# EAGLE board mainboard_eurobotics2010_r6 (EAGLE 4.16)
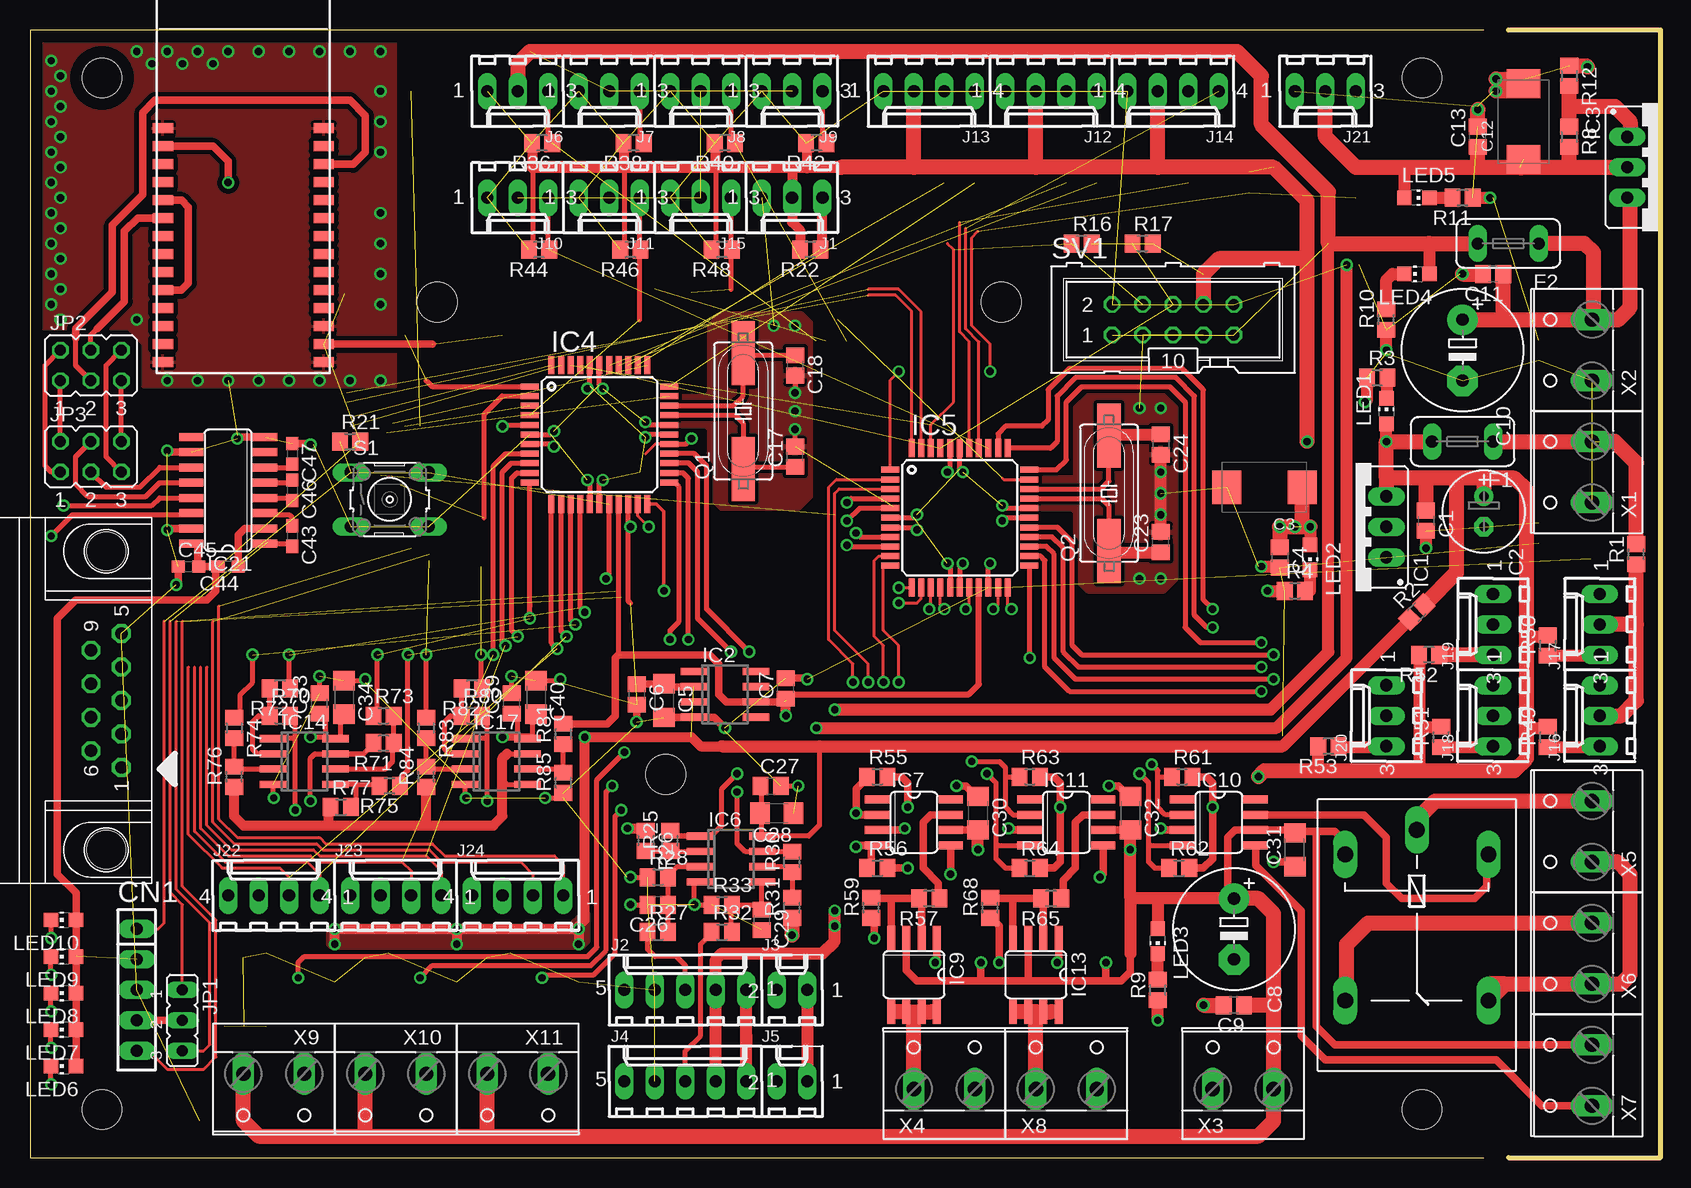
[diagram p9: board, top side]
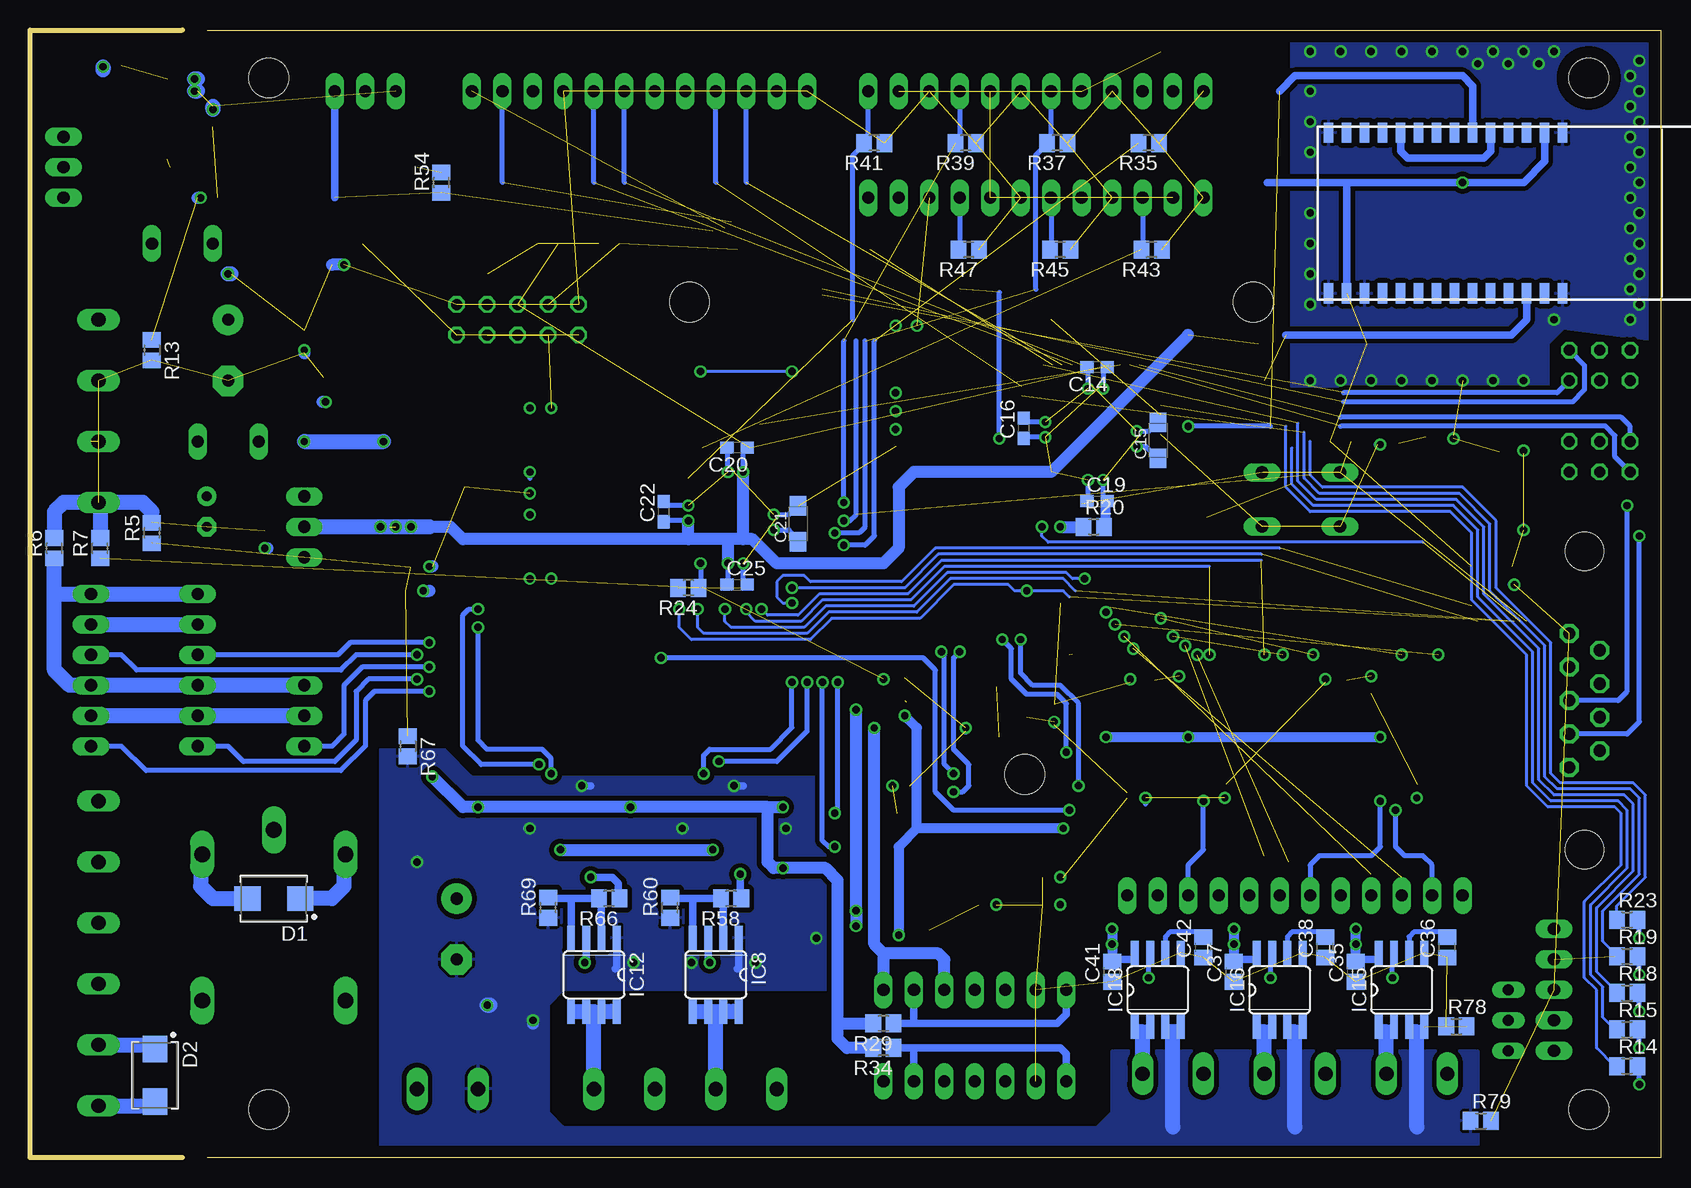
[diagram p10: board, bottom side, seen from below]

Size 135.89 x 94 mm. Coordinates in mm from the lower left corner, seen from the top.
Outline: 121.13,0 0,0 0,94 121.13,94
Outline: 123.19,0 135.89,0 135.89,93.98 123.19,93.98
Copper layers (1*16): Top 0.035mm / dielectric 1.5mm / Bottom 0.035mm
Design rules "olimex": minimum track width 10mil, minimum drill 24mil, track to track 8mil, track to pad 8mil, pad to pad 8mil, via to via 8mil, smd to smd 8mil, copper to edge 40mil, drill to drill 8mil, minimum pad ring 8mil, minimum via ring 8mil, stop-mask expansion 4mil, vias tented up to drill 0mil, thermal gap 10mil
Holes 3.3 mm at 6,4 116,4 6,90 116,90 80.93,71.31 33.94,71.31 52.99,31.94

## Footprints (pad centres in the part's own frame; a part is rotated, then mirrored left to right if it is on the bottom)
C0805 = smd 1.3 x 1.5: 1 -0.85,0; 2 0.85,0
E2,5-7 = drill 0.813 pad 1.6 round: + -1.27,0 | drill 0.813 pad 1.6 octagon: - 1.27,0
SMC_D = smd 2.4 x 2.8: + -3.15,0; - 3.15,0
C1206 = smd 1.6 x 1.8: 1 -1.4,0; 2 1.4,0
E5-10,5 = drill 1.016 pad 2.54 round: + -2.54,0 | drill 1.016 pad 2.54 octagon: - 2.54,0
C0603 = smd 1.1 x 1: 1 -0.85,0; 2 0.85,0
SMC_A = smd 1.6 x 1.4: + -1.5,0; - 1.5,0
SIP-100-5V = drill 1.016 long: 1 -5.08,0; 2 -2.54,0; 3 0,0; 4 2.54,0; 5 5.08,0
D-09F/90 = drill 1.016 pad 1.575 octagon: 1 -5.588,-1.27; 2 -2.794,-1.27; 3 0,-1.27; 4 2.794,-1.27; 5 5.588,-1.27; 6 -4.191,1.27; 7 -1.397,1.27; 8 1.397,1.27; 9 4.191,1.27 | hole 3.2: 12.446,0; -12.446,0
DIOM5436X265N = smd 2.2 x 2.05: A 2.2,0; K -2.2,0
TE5 = drill 1.016 long: 1 -2.54,0; 2 2.54,0
317TS = drill 1.016 long: 1 -2.54,-2.54; 2 0,-2.54; 3 2.54,-2.54
SOIC8 = smd 0.6 x 2.2: 1 -1.905,-2.6; 2 -0.635,-2.6; 3 0.635,-2.6; 4 1.905,-2.6; 5 1.905,2.6; 6 0.635,2.6; 7 -0.635,2.6; 8 -1.905,2.6
TQFP44 = smd 1.5 x 0.5: 1 -5.8,4; 2 -5.8,3.2; 3 -5.8,2.4; 4 -5.8,1.6; 5 -5.8,0.8; 6 -5.8,0; 7 -5.8,-0.8; 8 -5.8,-1.6; 9 -5.8,-2.4; 10 -5.8,-3.2; 11 -5.8,-4; 23 5.8,-4; 24 5.8,-3.2; 25 5.8,-2.4; 26 5.8,-1.6; 27 5.8,-0.8; 28 5.8,0; 29 5.8,0.8; 30 5.8,1.6; 31 5.8,2.4; 32 5.8,3.2; 33 5.8,4 | smd 0.5 x 1.5: 12 -4,-5.8; 13 -3.2,-5.8; 14 -2.4,-5.8; 15 -1.6,-5.8; 16 -0.8,-5.8; 17 0,-5.8; 18 0.8,-5.8; 19 1.6,-5.8; 20 2.4,-5.8; 21 3.2,-5.8; 22 4,-5.8; 34 4,5.8; 35 3.2,5.8; 36 2.4,5.8; 37 1.6,5.8; 38 0.8,5.8; 39 0,5.8; 40 -0.8,5.8; 41 -1.6,5.8; 42 -2.4,5.8; 43 -3.2,5.8; 44 -4,5.8
SO08 = smd 0.6 x 2.2: 1 -1.905,-2.6; 2 -0.635,-2.6; 3 0.635,-2.6; 4 1.905,-2.6; 5 1.905,2.6; 6 0.635,2.6; 7 -0.635,2.6; 8 -1.905,2.6
SO08' = smd 0.66 x 2.032: 1 -1.905,-3.073; 2 -0.635,-3.073; 3 0.635,-3.073; 4 1.905,-3.073; 5 1.905,3.073; 6 0.635,3.073; 7 -0.635,3.073; 8 -1.905,3.073
WT11 = smd 1.7 x 0.8: 1 -6.7,2.5; 2 -6.7,1; 3 -6.7,-0.5; 4 -6.7,-2; 5 -6.7,-3.5; 6 -6.7,-5; 7 -6.7,-6.5; 8 -6.7,-8; 9 -6.7,-9.5; 10 -6.7,-11; 11 -6.7,-12.5; 12 -6.7,-14; 13 -6.7,-15.5; 14 -6.7,-17; 15 6.7,-17; 16 6.7,-15.5; 17 6.7,-14; 18 6.7,-12.5; 19 6.7,-11; 20 6.7,-9.5; 21 6.7,-8; 22 6.7,-6.5; 23 6.7,-5; 24 6.7,-3.5; 25 6.7,-2; 26 6.7,-0.5; 27 6.7,1; 28 6.7,2.5
SO16 = smd 0.66 x 2.032: 1 -4.445,-3.073; 2 -3.175,-3.073; 3 -1.905,-3.073; 4 -0.635,-3.073; 5 0.635,-3.073; 6 1.905,-3.073; 7 3.175,-3.073; 8 4.445,-3.073; 9 4.445,3.073; 10 3.175,3.073; 11 1.905,3.073; 12 0.635,3.073; 13 -0.635,3.073; 14 -1.905,3.073; 15 -3.175,3.073; 16 -4.445,3.073
6410-03 = drill 1.016 long: 1 2.54,0; 2 0,0; 3 -2.54,0
6410-05 = drill 1.016 long: 1 5.08,0; 2 2.54,0; 3 0,0; 4 -2.54,0; 5 -5.08,0
6410-02 = drill 1.016 long: 1 1.27,0; 2 -1.27,0
6410-04 = drill 1.016 long: 1 3.81,0; 2 1.27,0; 3 -1.27,0; 4 -3.81,0
JP2 = drill 0.914 long: 1 -2.54,0; 2 0,0; 3 2.54,0
JP3Q = drill 0.914 octagon: 1 -2.54,-1.27; 2 -2.54,1.27; 3 0,-1.27; 4 0,1.27; 5 2.54,-1.27; 6 2.54,1.27
G5LE = drill 1.321 long: 1 -7.493,-5.969; 2 -7.493,5.969; O 4.699,5.969; P -9.525,0; S 4.699,-5.969
CHIP-LED0805 = smd 1.2 x 1.2: A 0,-1.05; C 0,1.05
HC49UP = smd 5.334 x 1.93: 1 -4.826,0; 2 4.826,0
R0805 = smd 1.3 x 1.5: 1 -0.85,0; 2 0.85,0
B3F-10XX = drill 1.016 long: 1 -3.251,2.261; 2 3.251,2.261; 3 -3.251,-2.261; 4 3.251,-2.261
ML10 = drill 0.914 octagon: 1 -5.08,-1.27; 2 -5.08,1.27; 3 -2.54,-1.27; 4 -2.54,1.27; 5 0,-1.27; 6 0,1.27; 7 2.54,-1.27; 8 2.54,1.27; 9 5.08,-1.27; 10 5.08,1.27
W237-132 = drill 1.194 long: 1 -2.54,-0.635; 2 2.54,-0.635

## Placement (x,y rotation side)
C1  100nF  [C0805]  116.33,53.09 270 top
C2  220uF/10V  [E2,5-7]  121.16,53.85 270 top
C3  47uF/6V  [SMC_D]  102.87,55.88 180 top
C4  100nF  [C0805]  104.14,50.04 270 top
C5  10uF/10V  [C1206]  52.83,38.1 270 top
C6  100nF  [C0805]  50.55,38.61 270 top
C7  100nF  [C0805]  62.99,39.12 90 top
C8  220uF/35V  [E5-10,5]  100.33,19.05 270 top
C9  100nF  [C0805]  100.33,12.7 180 top
C10  220uF/35V  [E5-10,5]  119.38,67.31 270 top
C11  100nF  [C0805]  121.92,73.66 180 top
C12  47uF/16V  [SMC_D]  124.46,86.36 90 top
C13  100nF  [C0805]  120.65,85.09 90 top
C14  100nF  [C0603]  46.96,65.89 180 bottom
C15  10uF/6V/lowESR  [SMC_A]  41.88,59.79 90 bottom
C16  100nF  [C0603]  53.06,60.81 90 bottom
C17  22pF  [C0805]  63.75,58.42 90 top
C18  22pF  [C0805]  63.75,66.04 270 top
C19  100nF  [C0603]  46.96,54.71 0 bottom
C20  100nF  [C0603]  76.96,59.18 180 bottom
C21  10uF/6V/lowESR  [SMC_A]  71.88,52.83 90 bottom
C22  100nF  [C0603]  83.06,53.85 90 bottom
C23  22pF  [C0805]  94.23,51.31 90 top
C24  22pF  [C0805]  94.23,59.44 270 top
C25  100nF  [C0603]  76.96,47.75 0 bottom
C26  C1  [C0805]  52.32,21.08 180 top
C27  100nF  [C0805]  61.72,30.99 0 top
C28  10uF/10V  [C1206]  62.23,28.7 180 top
C29  C1  [C0805]  60.96,19.81 270 top
C30  10uF/35V  [C1206]  78.99,28.7 270 top
C31  10uF/35V  [C1206]  105.41,25.65 90 top
C32  10uF/35V  [C1206]  91.69,28.7 270 top
C33  100nF  [C0805]  24.13,37.85 90 top
C34  10uF/10V  [C1206]  26.16,38.35 270 top
C35  100nF  [C0805]  25.4,15.49 90 bottom
C36  100nF  [C0805]  17.78,17.53 90 bottom
C37  100nF  [C0805]  35.56,15.49 90 bottom
C38  100nF  [C0805]  27.94,17.53 90 bottom
C39  100nF  [C0805]  40.13,37.85 90 top
C40  10uF/10V  [C1206]  42.16,38.35 270 top
C41  100nF  [C0805]  45.72,15.49 90 bottom
C42  100nF  [C0805]  38.1,17.53 90 bottom
C43  100nF  [C0603]  21.84,51.82 270 top
C44  100nF  [C0603]  16.51,49.28 180 top
C45  100nF  [C0603]  13.21,49.28 0 top
C46  100nF  [C0603]  21.84,55.63 270 top
C47  100nF  [C0603]  21.84,58.67 270 top
CN1  [SIP-100-5V]  8.89,13.97 270 top
CON1  [D-09F/90]  6.35,38.1 90 top
D1  SS24  [DIOM5436X265N]  115.57,21.59 180 bottom
D2  SS24  [DIOM5436X265N]  125.48,6.86 270 bottom
F1  FUSETE5  [TE5]  119.38,59.69 180 top
F2  FUSETE5  [TE5]  123.19,76.2 180 top
IC1  LM1086CT-3.3  [317TS]  110.49,52.58 90 top
IC2  ADR443BRZ-R-8  [SOIC8]  57.91,38.61 270 top
IC3  LM338T  [317TS]  135.64,82.55 270 top
IC4  DSPIC33FJXXMC804SMD  [TQFP44]  47.45,60.28 0 top
IC5  DSPIC33FJXXMC804SMD  [TQFP44]  77.47,53.34 0 top
IC6  MCP6022SN  [SO08]  58.42,24.89 270 top
IC7  TC4427  [SO08']  73.66,27.94 270 top
IC8  IRF7389  [SO08']  78.74,15.24 180 bottom
IC9  IRF7389  [SO08']  73.66,15.24 180 top
IC10  TC4427  [SO08']  99.06,27.94 270 top
IC11  TC4427  [SO08']  86.36,27.94 270 top
IC12  IRF7389  [SO08']  88.9,15.24 180 bottom
IC13  IRF7389  [SO08']  83.82,15.24 180 top
IC14  MCP6022SN  [SO08]  22.86,33.02 270 top
IC15  ADS713  [SO08']  21.59,13.97 0 bottom
IC16  ADS713  [SO08']  31.75,13.97 0 bottom
IC17  MCP6022SN  [SO08]  38.86,33.02 270 top
IC18  ADS713  [SO08']  41.91,13.97 0 bottom
IC19  WT11A  [WT11]  17.78,83.31 0 top
IC20  WT11A  [WT11]  10.67,78.74 270 bottom
IC21  MAX232ACSE  [SO16]  16.51,55.63 90 top
J1  [6410-03]  63.5,80.01 180 top
J2  [6410-05]  54.61,13.97 0 top
J3  [6410-02]  63.5,13.97 0 top
J4  [6410-05]  54.61,6.35 0 top
J5  [6410-02]  63.5,6.35 0 top
J6  [6410-03]  40.64,88.9 180 top
J7  [6410-03]  48.26,88.9 180 top
J8  [6410-03]  55.88,88.9 180 top
J9  [6410-03]  63.5,88.9 180 top
J10  [6410-03]  40.64,80.01 180 top
J11  [6410-03]  48.26,80.01 180 top
J12  [6410-04]  85.09,88.9 180 top
J13  [6410-04]  74.93,88.9 180 top
J14  [6410-04]  95.25,88.9 180 top
J15  [6410-03]  55.88,80.01 180 top
J16  [6410-03]  130.81,36.83 90 top
J17  [6410-03]  130.81,44.45 90 top
J18  [6410-03]  121.92,36.83 90 top
J19  [6410-03]  121.92,44.45 90 top
J20  [6410-03]  113.03,36.83 90 top
J21  [6410-03]  107.95,88.9 180 top
J22  [6410-04]  20.32,21.84 0 top
J23  [6410-04]  30.48,21.84 0 top
J24  [6410-04]  40.64,21.84 0 top
JP1  [JP2]  12.7,11.43 270 top
JP2  [JP3Q]  5.08,66.04 0 top
JP3  [JP3Q]  5.08,58.42 0 top
K1  G5LE  [G5LE]  115.57,17.78 270 top
LED1  [CHIP-LED0805]  113.03,62.23 0 top
LED2  [CHIP-LED0805]  106.68,50.04 180 top
LED3  [CHIP-LED0805]  93.98,18.03 180 top
LED4  [CHIP-LED0805]  115.57,73.66 90 top
LED5  [CHIP-LED0805]  115.57,80.01 270 top
LED6  [CHIP-LED0805]  2.79,7.62 90 top
LED7  [CHIP-LED0805]  2.79,10.67 90 top
LED8  [CHIP-LED0805]  2.79,13.72 90 top
LED9  [CHIP-LED0805]  2.79,16.76 90 top
LED10  [CHIP-LED0805]  2.79,19.81 90 top
Q1  10MHz  [HC49UP]  59.44,62.23 90 top
Q2  10MHz  [HC49UP]  89.92,55.37 90 top
R1  0R  [R0805]  133.86,50.29 90 top
R2  0R  [R0805]  115.57,45.47 45 top
R3  470R  [R0805]  112.27,65.02 0 top
R4  270R  [R0805]  105.41,47.24 0 top
R5  0R  [R0805]  125.73,52.07 90 bottom
R6  0R  [R0805]  133.86,50.8 90 bottom
R7  0R  [R0805]  130.05,50.8 90 bottom
R8  240R/1%  [R0805]  128.27,85.09 270 top
R9  2K7  [R0805]  93.98,13.97 90 top
R10  1K  [R0805]  113.03,69.85 90 top
R11  1K  [R0805]  119.38,80.01 180 top
R12  1K6/1%  [R0805]  128.27,90.17 270 top
R13  0R  [R0805]  125.73,67.31 270 bottom
R14  270R  [R0805]  2.79,7.62 0 bottom
R15  270R  [R0805]  2.79,10.67 0 bottom
R16  4K7  [R0805]  87.63,76.2 0 top
R17  4K7  [R0805]  92.71,76.2 0 top
R18  270R  [R0805]  2.79,13.72 0 bottom
R19  270R  [R0805]  2.79,16.76 0 bottom
R20  0R  [R0805]  47.24,52.58 0 bottom
R21  10K  [R0805]  26.67,59.69 0 top
R22  4K7  [R0805]  65.02,75.69 180 top
R23  270R  [R0805]  2.79,19.81 0 bottom
R24  0R  [R0805]  81.03,47.5 180 bottom
R25  RD  [R0805]  53.34,26.42 90 top
R26  RC  [R0805]  51.31,26.42 270 top
R27  RA  [R0805]  52.32,18.8 0 top
R28  RB  [R0805]  52.32,23.37 0 top
R29  4K7  [R0805]  64.77,11.18 180 bottom
R30  RD  [R0805]  63.5,24.64 90 top
R31  RC  [R0805]  63.5,20.83 90 top
R32  RA  [R0805]  57.66,18.8 0 top
R33  RB  [R0805]  57.66,21.08 0 top
R34  4K7  [R0805]  64.77,9.14 180 bottom
R35  4K7  [R0805]  42.67,84.58 180 bottom
R36  4K7  [R0805]  42.67,84.58 180 top
R37  4K7  [R0805]  50.29,84.58 180 bottom
R38  4K7  [R0805]  50.29,84.58 180 top
R39  4K7  [R0805]  57.91,84.58 180 bottom
R40  4K7  [R0805]  57.91,84.58 180 top
R41  4K7  [R0805]  65.53,84.58 180 bottom
R42  4K7  [R0805]  65.53,84.58 180 top
R43  4K7  [R0805]  42.42,75.69 180 bottom
R44  4K7  [R0805]  42.42,75.69 180 top
R45  4K7  [R0805]  50.04,75.69 180 bottom
R46  4K7  [R0805]  50.04,75.69 180 top
R47  4K7  [R0805]  57.66,75.69 180 bottom
R48  4K7  [R0805]  57.66,75.69 180 top
R49  4K7  [R0805]  126.49,35.05 90 top
R50  4K7  [R0805]  126.49,42.67 90 top
R51  4K7  [R0805]  117.6,35.05 90 top
R52  4K7  [R0805]  116.59,41.91 180 top
R53  4K7  [R0805]  108.2,34.29 180 top
R54  4K7  [R0805]  101.6,81.28 90 bottom
R55  2K2  [R0805]  70.61,31.75 0 top
R56  2K2  [R0805]  70.61,24.13 0 top
R57  22R  [R0805]  74.93,21.59 180 top
R58  22R  [R0805]  77.47,21.59 180 bottom
R59  2K2  [R0805]  70.1,20.83 90 top
R60  2K2  [R0805]  82.55,20.83 90 bottom
R61  2K2  [R0805]  96.01,31.75 0 top
R62  2K2  [R0805]  95.76,24.13 0 top
R63  2K2  [R0805]  83.31,31.75 0 top
R64  2K2  [R0805]  83.31,24.13 0 top
R65  22R  [R0805]  85.09,21.59 180 top
R66  22R  [R0805]  87.63,21.59 180 bottom
R67  0R  [R0805]  104.39,34.29 270 bottom
R68  2K2  [R0805]  80.01,20.83 90 top
R69  2K2  [R0805]  92.71,20.83 90 bottom
R70  2K/1%  [R0805]  20.83,36.83 0 top
R71  2K/1%  [R0805]  29.46,34.54 180 top
R72  1K/1%  [R0805]  20.83,39.12 180 top
R73  1K/1%  [R0805]  29.46,36.83 0 top
R74  1K/1%  [R0805]  17.02,35.81 270 top
R75  1K/1%  [R0805]  29.97,30.99 180 top
R76  2K/1%  [R0805]  17.02,31.75 90 top
R77  2K/1%  [R0805]  25.91,29.21 0 top
R78  0R  [R0805]  17.02,10.92 0 bottom
R79  0R  [R0805]  14.99,3.05 0 bottom
R80  2K/1%  [R0805]  36.83,36.83 0 top
R81  1K/1%  [R0805]  44.45,35.31 90 top
R82  1K/1%  [R0805]  36.83,39.12 180 top
R83  1K/1%  [R0805]  33.02,35.81 270 top
R84  2K/1%  [R0805]  33.02,31.75 90 top
R85  2K/1%  [R0805]  44.45,31.24 90 top
S1  [B3F-10XX]  29.97,54.86 0 top
SV1  [ML10]  95.25,69.85 0 top
X1  [W237-132]  129.54,57.15 90 top
X2  [W237-132]  129.54,67.31 90 top
X3  [W237-132]  101.09,6.35 0 top
X4  [W237-132]  76.2,6.35 0 top
X5  [W237-132]  129.54,27.18 90 top
X6  [W237-132]  129.54,17.02 90 top
X7  [W237-132]  129.54,6.86 90 top
X8  [W237-132]  86.36,6.35 0 top
X9  [W237-132]  20.32,6.35 180 top
X10  [W237-132]  30.48,6.35 180 top
X11  [W237-132]  40.64,6.35 180 top

## Tracks (layer width: path | path; a pad name or v marks a point on that pad's centre or on a via)
0V  (via drill 0.61)  (1 unrouted)
  Top 0.406: 73.03,27.3 v72.9,27.43
  Top 0.61: IC10.3 94.36,27.3 v94.23,27.43 | IC9.1 75.56,16.38 v75.44,16.26 | v70.36,18.29 70.36,19.81 70.19,19.98 R59.1 | C31.1 105.41,24.38 105.16,24.64 v103.63,24.64 | C32.1 91.56,30.1 90.68,30.99 v89.92,30.99 | IC13.1 85.72,16.38 v85.6,16.26 | C30.1 78.86,30.1 77.98,30.99 v77.22,30.99 | IC11.3 81.41,27.3 v81.53,27.43 | IC7.3 73.03,27.3 | v80.77,16.26 80.77,19.3 80.01,20.07
  Top 0.813: 80.01,20.07 R68.1
  Top 1.016: v93.98,11.43 R9.1
  Top 1.27: v97.79,12.7 C9.2
  Bottom 0.406: IC15.4 19.79,10.9 19.81,10.92 19.84,10.9 IC15.3 20.34,10.9 20.32,10.92 20.32,10.16 | IC18.3 40.16,10.9 40.13,10.92 40.11,10.9 IC18.4 40.62,10.9 40.64,10.92 40.64,10.16 | IC16.4 30.96,10.9 30.99,10.92 31.01,10.9 IC16.3 30.5,10.9 30.48,10.92 30.48,10.16 | v72.9,27.43 72.9,27.18
  Bottom 0.61: v94.23,27.43 94.49,27.43 | IC8.1 76.83,15.88 76.96,15.75 | v103.63,24.64 103.63,24.89 | v89.92,30.99 89.15,30.99 | IC12.1 87,15.88 87.12,15.75 | v77.22,30.99 76.45,30.99 | v81.53,27.43 81.28,27.43 | v80.77,16.26 80.77,16
  Bottom 1.016: v93.98,11.43 93.98,11.18
  Bottom 1.27: v97.79,12.7 97.54,12.7 | 20.32,2.54 20.32,10.16 | 40.64,2.54 40.64,10.16 | 30.48,2.54 30.48,10.16
  pour Bottom (isolate 0.406): 106.68,-1.27 106.68,34.04 101.35,34.04 99.06,31.75 68.58,31.75 68.58,13.97 91.44,13.97 92.71,12.7 92.71,3.81 91.44,2.54 46.99,2.54 45.72,3.81 45.72,8.89 15.24,8.89 15.24,-1.27
+3V3  (via drill 0.61)  (9 unrouted)
  Top 0.254: 3.84,22.06 3.81,22.1
  Top 0.305: LED7.A 3.81,10.67 3.84,10.63 | LED8.A 3.81,13.72 3.84,13.68 | LED9.A 3.81,16.76 3.84,16.73 | LED10.A 3.81,19.81 3.84,19.78
  Top 0.406: 77.47,47.5 IC5.17 77.47,49.28 v77.72,49.53 | v81.03,53.09 81.28,53.34 IC5.28 | IC5.40 76.67,57.37 v76.45,57.15 | IC4.17 47.45,56.22 v47.72,56.49 | IC4.28 51.55,60.28 v51.28,60.04 | IC4.40 46.65,64.31 v46.45,64.11
  Top 0.61: 13.97,49.28 C45.2 | IC21.16 13.97,51.18 13.97,49.28 | 13.97,49.28 C44.2 15.75,49.28 15.49,49.02 15.49,47.24 14.73,46.48 3.81,46.48 2.29,44.96 2.29,23.62 3.81,22.1 | LED6.A 3.84,10.63 | LED7.A 3.84,13.68 | LED8.A 3.84,16.73 | LED9.A 3.84,19.78 | LED10.A 3.84,22.06 | IC19.2 15.26,84.31 16.51,83.06 v16.51,81.28 | IC19.16 33.52,67.81 33.53,67.82
  Top 1.016: v106.68,52.58 LED2.A
  Top 1.27: 105.92,52.58 v104.14,52.58 C4.1 | v106.68,52.58 105.92,52.58 | C3.+ 106.02,52.68 105.92,52.58
  Bottom 0.254: 47.72,54.71 C19.1 | 53.06,60.04 C16.1
  Bottom 0.406: 77.72,47.75 C25.1 | v77.72,49.53 77.72,47.75 | 77.72,47.75 77.47,47.75 | 83.06,53.09 C22.1 | 83.06,53.09 83.06,53.34 | v81.03,53.09 83.06,53.09 | 75.95,59.18 C20.1 76.45,59.18 v76.45,57.15 | v47.72,56.49 47.72,54.71 | v51.28,60.04 53.06,60.04 | C14.1 46.2,65.89 46.45,65.63 v46.45,64.11
  Bottom 0.61: 26.16,81.28 v16.51,81.28 11.43,81.28 9.67,83.04 IC20.2 | 26.16,81.28 32.77,81.28 | IC20.16 26.17,81.27 26.16,81.28
  Bottom 1.016: 102.62,52.58 100.84,52.58 99.82,51.56 81.03,51.56 | 76.45,51.56 75.69,51.56 73.66,49.53 64.77,49.53 63.5,50.8 63.5,55.88 62.23,57.15 50.8,57.15 39.37,68.58 | 76.45,51.56 77.72,51.56 | 77.72,51.56 81.03,51.56 | 81.03,51.56 v81.03,53.09 | 76.45,51.56 v76.45,57.15 | 77.72,51.56 v77.72,49.53
  Bottom 1.27: 102.62,52.58 v106.68,52.58 IC1.2
  other vias: 105.41,52.58
+3V_VREF  (via drill 0.61)  (2 unrouted)
  Top 0.406: 49.05,41.94 IC4.19
  Top 0.508: IC5.19 79.07,39.45 78.23,38.61 63.25,38.61 62.99,38.35 C7.1 | 49.02,41.91 49.05,41.94
  Top 0.61: 62.87,37.97 IC2.6 58.04,37.97 57.4,38.61 57.4,41.15 56.64,41.91 49.28,41.91 | R81.2 48.09,36.16 48.77,36.83 48.77,41.66 49.02,41.91
  Top 0.813: C7.1 62.99,38.1 v62.99,36.83 | R26.1 51.22,27.27 51.05,27.43 v49.78,27.43
  Top 1.27: v63.5,18.54 R31.1
  Bottom 0.813: v63.5,18.54 63.5,25.91 61.98,27.43 | 61.98,27.43 61.98,35.81 v62.99,36.83 | v49.78,27.43 61.98,27.43
+5V  (via drill 0.61)  (3 unrouted)
  Top 0.406: 41.91,82.55 41.91,75.95 41.66,75.95 41.66,75.69 R44.2 | 49.53,82.55 49.53,75.95 49.28,75.95 49.28,75.69 R46.2 | 57.15,82.55 57.15,75.95 56.9,75.69 R48.2
  Top 0.61: R61.2 98.04,31.75 98.55,31.24 v98.55,29.21 98.55,24.89 97.79,24.13 R62.2 | 71.88,31.75 R55.2 72.64,31.75 73.15,31.24 v73.15,29.21 | R63.2 85.34,31.75 85.85,31.24 v85.85,29.21 85.85,24.64 85.34,24.13 R64.2 | v73.15,24.13 R56.2
  Top 0.813: 41.91,82.55 41.91,84.58 | 49.53,82.55 49.53,84.58 | 64.77,82.55 64.77,84.58 | R40.2 57.15,84.58 57.15,82.55 | 63.5,82.55 J1.2 63.5,77.98 64.17,77.3 R22.2
  Top 1.016: R49.2 126.49,35.81 124.71,35.81 | R50.2 126.49,43.43 124.71,43.43 | v113.03,59.69 LED1.A | 41.91,84.58 R36.2 | 41.91,82.55 49.53,82.55 57.15,82.55 63.5,82.55 64.77,82.55 67.56,82.55 | 49.53,84.58 R38.2 | 64.77,84.58 R42.2 | 115.74,41.82 115.82,41.91 115.82,35.81 | 115.82,32.51 115.82,35.81 | R51.2 115.91,35.9 115.82,35.81 | R53.2 107.35,32.42 107.19,32.26
  Top 1.27: F1.2 v113.03,59.69 113.03,56.64 | 113.03,56.64 IC1.3 | 121.16,56.64 C2.+ | 116.33,56.64 113.03,56.64 | 116.33,56.64 C1.1 | R2.2 118.87,48.77 118.87,56.64 | 118.87,56.64 116.33,56.64 | 121.16,56.64 118.87,56.64 | 121.16,56.64 123.7,56.64 124.71,55.63 124.71,43.43 124.71,35.81 124.71,33.27 123.7,32.26 115.57,32.26 | 106.43,74.93 106.43,79.76 103.63,82.55 93.98,82.55 | v106.43,59.69 106.43,74.93 | 83.82,82.55 73.66,82.55 | 93.98,82.55 83.82,82.55 | 73.66,82.55 67.56,82.55 | 93.98,82.55 J14.2 | 73.66,82.55 J13.2 | 83.82,82.55 J12.2 | SV1.8 97.79,73.66 99.06,74.93 106.43,74.93 | 115.57,32.26 107.19,32.26 102.87,32.26 v102.36,31.75 | 115.74,41.82 R52.2 | 115.57,32.26 115.82,32.51
  Bottom 1.016: 74.42,29.21 v85.85,29.21 v98.55,29.21 99.82,29.21 v102.36,31.75 | 74.42,29.21 v73.15,29.21 | 74.42,29.21 74.42,24.64 73.91,24.13 v73.15,24.13 69.6,24.13 68.58,23.11 68.58,11.18 | 68.58,11.18 68.58,9.91 67.82,9.14 R34.2 65.53,9.14 | 68.58,11.18 R29.2
  Bottom 1.27: v113.03,59.69 v106.43,59.69
+5V_ANALOG  (via drill 0.61)  (1 unrouted)
  Top 0.406: 60.96,28.7 60.96,26.8 IC6.8 64.9,26.8 65.79,27.69 65.79,34.29 | C27.1 60.96,30.99 60.96,28.7 | 60.96,28.7 C28.2 | 25.91,35.05 25.78,34.92 IC14.8 24.77,34.92 24.64,35.05 24.64,36.58 24.22,37 C33.1 | 25.91,35.05 25.91,36.58 26.16,36.83 C34.2 26.03,36.95 25.91,36.83 25.91,35.05 | C39.1 40.22,37 40.64,36.58 40.64,35.05 40.77,34.92 IC17.8 41.78,34.92 41.91,35.05 41.91,36.32 | 41.91,36.32 41.91,36.58 42.16,36.83 C40.2 42.16,36.58 41.91,36.32 | v23.37,35.05 25.91,35.05
  Top 0.61: v39.37,35.05 41.91,35.05 | IC2.2 53.21,39.24 52.83,39.62 C5.1 50.68,39.5 50.55,39.37
  Top 0.813: v25.4,17.78 v25.4,19.05 v35.56,19.05 | v35.56,19.05 v35.56,17.78 | v35.56,19.05 v35.56,17.78 | v35.56,19.05 v35.56,17.78 | v45.72,19.05 v45.72,17.78 | v45.72,19.05 v45.72,17.78 | v35.56,19.05 v35.56,17.78 | v45.72,19.05 v45.72,17.78 | v45.72,19.05 v45.72,17.78 | v45.72,19.05 45.72,19.3 46.23,19.81 v46.23,35.05 55.12,35.05 55.88,34.29 57.66,34.29 | v35.56,19.05 v45.72,19.05 | C6.1 50.55,39.37
  Top 1.016: R2.1 104.39,34.29 65.79,34.29 57.66,34.29
  Bottom 0.61: IC15.8 23.5,16.64 23.62,16.51 25.4,16.51 | IC16.8 33.66,16.64 33.78,16.51 35.56,16.51 | IC18.8 43.81,16.64 43.94,16.51 45.72,16.51
  Bottom 0.813: C35.2 25.4,16.51 v25.4,17.78 v25.4,19.05 | C37.2 35.56,16.51 v35.56,17.78 v35.56,19.05 | C41.2 45.72,16.51 v45.72,17.78 v45.72,19.05 | v23.37,35.05 v39.37,35.05 v46.23,35.05
  pour Top: 46.48,20.32 46.48,18.03 45.97,17.53 25.15,17.53 24.89,17.78 24.89,19.05 25.15,19.3 44.96,19.3 45.97,20.32
+12V  (via drill 0.61)  (8 unrouted)
  Top 1.016: LED4.A 116.62,76.17 116.59,76.2 | J4.2 J2.2 57.15,16.51 57.66,17.02 66.04,17.02 67.06,18.03 v67.06,20.57 | 108.2,76.2 108.2,42.16 103.38,37.34 v67.06,37.34
  Top 1.27: F2.2 116.59,76.2 108.2,76.2 108.2,80.52 102.62,86.11 102.62,90.17 100.58,92.2 41.66,92.2 40.64,91.19 J6.2
  Bottom 1.016: v67.06,19.3 v67.06,20.57 v67.06,37.34
+24V  (via drill 0.61)
  Top 0.61: C8.+ 99.82,22.1 99.82,26.67 100.46,27.3 IC10.6 105.28,27.3 105.41,27.18 | 105.92,26.67 105.53,27.05 C31.2 105.41,27.18 | K1.1 109.6,26.29 108.71,27.18 107.19,27.18 | 105.41,27.18 107.19,27.18 | 107.19,27.18 107.19,10.92 108.71,9.4 X7.2 130.3,9.4 | C32.2 | C32.2 IC11.6 | C32.2 91.69,27.43 | C30.2 78.99,27.43 78.87,27.3 IC7.6 | IC9.3 73.03,15.62 73.91,14.73 79.25,14.73 | 89.66,14.73 83.31,14.73 | 91.69,17.02 91.69,15.49 90.93,14.73 89.66,14.73 | IC13.3 83.19,14.86 83.31,14.73 | 83.31,14.73 79.25,14.73 | 79.25,14.73 v79.25,16.26 | 89.66,14.73 v89.66,16.26
  Top 1.016: C8.+ 93.98,21.59 | 93.98,21.59 91.69,21.59 | C32.2 v91.69,25.65 91.69,21.59 | 93.98,21.59 LED3.A | v78.99,25.65 C30.2 | 91.69,21.59 91.69,17.02
  Top 1.27: 103.63,12.7 103.63,20.32 102.36,21.59 C8.+ | 103.63,12.7 C9.1 | 103.63,5.84 103.63,12.7 | X9.2 17.78,3.05 19.05,1.78 27.94,1.78 | 27.94,1.78 38.1,1.78 | 38.1,1.78 102.36,1.78 103.63,3.05 103.63,5.84 | 103.63,5.84 X3.2 | 27.94,1.78 X10.2 | 38.1,1.78 X11.2
  Bottom 0.61: IC8.3 79.38,16.38 v79.25,16.26 | IC12.3 89.53,16.38 v89.66,16.26
  Bottom 1.016: v91.69,25.65 v78.99,25.65
  Bottom 1.27: D1.K 110.74,21.59 109.73,22.61 109.73,25.15 K1.1 | D2.K 125.48,9.4 X7.2
AGND  (via drill 0.61)  (30 unrouted)
  Top 0.406: C27.2 v64.01,30.99 | v50.04,23.37 R28.1 | v50.04,21.08 C26.2 | R33.1 v55.37,21.08 55.37,22.86 55.5,22.99 IC6.4 | IC17.4 36.26,30.03 v36.32,29.97 | IC14.4 20.26,30.03 v20.32,29.97 | C39.2 v40.13,40.13 | C40.1 44.07,39.75 v44.2,39.88 | C34.1 27.82,39.75 v27.94,39.88 | C33.2 v24.13,40.13 | R85.1 44.45,29.97 v42.93,29.97 | IC5.20 79.87,49.39 v80.01,49.53 | 49.85,52.58 49.85,46.41 50.04,46.23 | 49.85,52.58 IC4.20 | 49.85,52.58 v50.04,52.58
  Top 0.61: C6.2 v50.55,36.32 | C7.2 64.68,39.97 v64.77,39.88 | v57.91,35.81 57.02,36.7 IC2.4 53.21,36.7 53.09,36.58 52.96,36.7 C5.2
  Bottom 0.406: v64.01,30.99 64.26,30.99 | v50.04,23.37 49.78,23.37 | v50.04,21.08 49.78,21.08 | v55.37,21.08 55.37,21.34 | v36.32,29.97 36.07,29.97 | 20.07,29.97 v20.32,29.97 | v40.13,40.13 40.13,40.39 | v44.2,39.88 44.2,39.62 | v27.94,39.88 27.94,39.62 | v24.13,40.13 24.13,40.39 | v42.93,29.97 42.93,29.46 | R24.1 80.01,47.5 v80.01,49.53
  Bottom 0.61: v57.91,35.81 57.91,35.56 | v50.55,36.32 50.55,36.07
  Bottom 1.016: v50.04,52.58 R20.1
ARM_ENC_CHA  (1 unrouted)
  Top 0.254: IC5.38 78.27,68.03 77.47,68.83 77.47,77.98
  Bottom 0.406: 96.52,81.28 J14.3
ARM_ENC_CHB  (1 unrouted)
  Top 0.254: IC5.37 79.07,68 77.98,69.09 77.98,77.47
ARM_MOT_BREAK  (via drill 0.61)  (1 unrouted)
  Top 0.254: J24.1 44.45,24.38 43.69,25.15 34.54,25.15 33.53,26.16 24.64,26.16 24.13,26.67 17.27,26.67 15.75,28.19 15.75,45.97 | IC5.13 74.27,46.58 73.91,46.23 v72.39,46.23
  Bottom 0.254: v72.39,46.23 73.15,46.23 73.66,46.74 73.66,48.01 73.15,48.51 71.37,48.51 70.87,48.01 63.25,48.01 60.45,50.8 31.75,50.8
ARM_MOT_CURRENT  (via drill 0.61)
  Top 0.406: v42.67,14.99 42.93,15.24 46.99,15.24 48.77,17.02 48.77,28.45 v49.28,28.96 | IC5.23 83.27,49.32 83.31,49.28 v83.31,41.66
  Bottom 0.406: IC18.7 42.55,16.38 42.67,16.26 v42.67,14.99 | v49.28,28.96 58.93,28.96 60.45,30.48 60.45,40.64 61.47,41.66 v83.31,41.66
ARM_MOT_REV  (via drill 0.61)  (1 unrouted)
  Top 0.254: IC5.12 72.69,47.54 v72.39,47.5 | J24.2 41.91,23.62 40.89,24.64 34.29,24.64 33.27,25.65 24.38,25.65 23.88,26.16 17.02,26.16 15.24,27.94 15.24,44.7
  Bottom 0.254: v72.39,47.5 62.99,47.5 60.2,50.29 33.27,50.29
ARM_MOT_VREF_N  (via drill 0.61)  (1 unrouted)
  Top 0.254: IC5.15 75.87,46.05 v76.2,45.72
  Top 0.305: R82.1 37.68,38.95 37.59,39.12
  Top 0.406: 37.59,39.12 v37.59,41.91
  Bottom 0.254: v76.2,45.72 76.2,45.47 75.44,44.7 71.63,44.7 69.85,46.48 62.48,46.48 59.69,49.28 37.59,49.28
ARM_MOT_VREF_P  (via drill 0.61)  (1 unrouted)
  Top 0.254: IC5.14 75.07,45.86 v74.93,45.72
  Top 0.406: R83.1 v33.02,41.91
  Bottom 0.254: v74.93,45.72 74.42,45.21 71.88,45.21 70.1,46.99 62.74,46.99 59.94,49.78 33.27,49.78
ARM_VREF  (via drill 0.61)
  Top 0.406: R80.2 37.59,36.83 38.1,36.32 38.1,35.05 | IC17.1 37.97,34.92 38.1,35.05 | v38.1,29.72 38.1,35.05
  Bottom 0.406: v38.1,29.72 38.1,25.65 39.37,24.38 J24.3
BEACON_UART_RX  (1 unrouted)
  Top 0.406: IC4.1 33.51,64.28 33.02,64.77
  Bottom 0.61: IC20.26 11.17,69.86 12.45,68.58 31.24,68.58
BEACON_UART_TX  (via drill 0.61)  (1 unrouted)
  Top 0.406: IC4.5 39.49,61.08 v39.37,60.96
  Bottom 0.406: 32.51,60.96 v39.37,60.96
  Bottom 0.61: IC20.6 15.67,89.33 16.51,90.17 30.48,90.17 31.75,88.9
COMPRESSOR_POWER  (via drill 0.61)
  Top 0.406: IC10.2 94.61,28.57 93.98,29.21 93.98,31.75 | 93.98,31.75 R61.1 | 93.98,31.75 93.98,32.26 v93.47,32.77 | IC5.35 80.67,60.35 81.28,60.96 84.33,60.96 84.84,61.47 84.84,64.01 86.61,65.79 96.01,65.79 97.79,64.01 97.79,46.48 v98.55,45.72
  Bottom 0.406: v98.55,45.72 99.31,45.72 99.82,45.21 99.82,34.29 98.3,32.77 v93.47,32.77
CORN_INSIDE_SENSOR  (via drill 0.61)  (1 unrouted)
  Top 0.406: R40.1 58.42,84.58 J8.3 | IC5.4 68.4,54.94 v68.07,54.61
  Bottom 0.406: R40.1 58.42,84.58 J8.3 | v68.07,54.61 68.07,68.07
CORN_PUSH_PWM_(5V)  (via drill 0.61)
  Top 0.406: R53.1 108.71,34.29 | IC5.26 85.17,51.74 86.11,50.8 86.11,42.16 87.38,40.89 v102.62,40.89
  Top 1.016: J20.3 112.94,34.2 109.31,34.2 109.22,34.29 R53.1
  Bottom 0.406: J20.3 110.74,34.29 109.73,35.31 109.73,39.37 108.2,40.89 v102.62,40.89
FROM_TX_RS232_M  (via drill 0.61)
  Top 0.406: IC21.13 10.79,54.99 10.16,54.36 v2.79,54.36
  Bottom 0.406: v2.79,54.36 2.79,38.86 3.56,38.1 CON1.3
G_RST  (via drill 0.61)  (4 unrouted)
  Top 0.254: CN1.1 10.67,19.05 11.18,19.56 11.18,44.7 | IC5.18 78.27,46.01 v77.98,45.72
  Top 0.406: IC4.18 48.26,48.51 v48.01,48.27 48,48.27 v48.01,48.26
  Bottom 0.254: v77.98,45.72 77.98,44.7 77.47,44.2 71.37,44.2 69.6,45.97 62.23,45.97 59.44,48.77 49.53,48.77 49.02,48.26 v48.01,48.26
GND  (via drill 0.61)  (29 unrouted)
  Top 0.406: v11.43,58.93 11.56,58.8 | IC5.16 76.67,49.31 v76.45,49.53 | IC5.29 81.24,54.14 v81.03,54.36 | v77.72,57.15 77.47,57.4 IC5.39 | IC5.6 73.66,53.34 v73.91,53.59 | IC4.16 46.65,56.29 v46.45,56.49 | IC4.29 51.51,61.08 v51.28,61.31 | IC4.6 43.39,60.28 v43.66,60.55 | IC4.39 47.45,64.38 v47.72,64.11 | C17.2 v63.75,60.71 | C18.2 v63.75,63.75
  Top 0.61: 11.56,58.8 IC21.10 | C47.1 23.28,59.52 v23.37,59.44 | IC21.8 17.4,60.07 v17.27,59.94 | C45.1 12.36,47.92 v12.19,47.75 | IC21.15 11.56,52.45 v11.43,52.32
  Top 1.016: v103.12,47.24 R4.1 | C4.2 104.14,49.28 v102.62,49.28 | C23.2 v94.23,53.59 v94.23,57.15 C24.2
  Bottom 0.254: C19.2 46.45,54.71 | 53.06,61.31 C16.2
  Bottom 0.406: v11.43,58.93 11.43,58.67 | 75.95,47.75 C25.2 76.45,47.75 v76.45,49.53 | 83.06,54.86 C22.2 83.06,54.36 v81.03,54.36 | 77.72,59.18 C20.2 | v77.72,57.15 77.72,59.18 | 77.72,59.18 77.47,59.18 | C21.- 71.88,53.85 72.39,53.85 72.64,53.59 v73.91,53.59 | v94.23,57.15 94.23,56.64 | v94.23,53.59 94.23,53.85 | 46.45,54.71 v46.45,56.49 | v51.28,61.31 53.06,61.31 | C15.- 42.64,60.55 v43.66,60.55 | C14.2 47.72,65.89 v47.72,64.11 | v63.75,63.75 63.75,63.5
  Bottom 0.61: v23.37,59.44 23.62,59.44 | v17.27,59.94 17.27,60.2 | v12.19,47.75 12.45,47.75 | v11.43,52.32 11.43,52.58
  Bottom 0.813: R20.2 46.39,52.67 46.23,52.83 46.23,54.61 46.13,54.71 C19.2
  Bottom 1.016: v103.12,47.24 102.62,47.24 | v102.62,49.28 102.36,49.28
  other vias: 2.54,69.85 1.78,71.12 2.54,72.39 1.78,73.66 2.54,74.93 1.78,76.2 2.54,77.47 1.78,78.74 2.54,80.01 1.78,81.28 2.54,82.55 1.78,83.82 2.54,85.09 1.78,86.36 2.54,87.63 1.78,88.9 2.54,90.17 1.78,91.44 8.89,92.2 10.16,91.19 11.43,92.2 12.7,91.19 13.97,92.2 15.24,91.19 16.51,92.2 19.05,92.2 21.59,92.2 24.13,92.2 26.67,92.2 29.21,92.2 29.21,88.9 29.21,86.36 29.21,83.82 29.21,78.74 29.21,76.2 29.21,73.66 29.21,71.12 29.21,64.77 26.67,64.77 24.13,64.77 21.59,64.77 19.05,64.77 16.51,64.77 13.97,64.77 11.43,64.77 8.89,69.85 94.23,48.26 94.23,62.48 63.75,69.34 63.75,62.23 61.98,69.34 92.46,62.48 92.46,48.26 94.23,55.37
  pour Top (isolate 0.406): -2.54,69.09 8.13,69.09 9.4,67.82 9.4,64.26 30.48,64.26 30.48,93.98 0,93.98
  pour Bottom (isolate 0.406): -1.78,67.82 8.13,69.09 9.4,67.82 9.4,64.26 30.73,64.26 30.73,93.98 -0.51,93.98
  pour Top (isolate 0.305): 83.06,54.1 86.87,54.1 87.12,53.85 87.12,48.26 88.14,47.24 94.49,47.24 95.5,48.26 95.5,62.48 94.49,63.5 88.14,63.5 87.12,62.48 87.12,56.64 83.06,56.64
  pour Top (isolate 0.305): 53.09,63.5 56.39,63.5 56.64,63.75 56.64,69.34 57.66,70.36 64.26,70.36 65.02,69.6 65.02,55.12 64.01,54.1 57.66,54.1 56.64,55.12 56.64,60.71 56.39,60.96 53.09,60.96
GND_SERVO_5V
  Bottom 1.27: 133.86,46.99 133.86,40.64 132.59,39.37 J16.1 J18.1 J20.1 | 133.86,46.99 R6.1 | 133.86,46.99 J17.1 J19.1
GND_SERVO_9.6V  (via drill 0.61)  (5 unrouted)
  Top 1.016: R11.1 v121.67,80.01
  Top 1.27: R12.1 129.71,91.02 v129.79,90.93 | C13.2 v120.65,87.38 | v122.17,88.9 124.46,88.9 C12.- 124.46,89.92 v122.17,89.92
  Bottom 1.016: v121.67,80.01 121.92,80.01
  Bottom 1.27: v129.79,90.93 129.79,90.68 | v120.65,87.38 120.65,87.63 | v122.17,88.9 121.92,88.9 | v122.17,89.92 121.92,89.92
GNDIO  (via drill 0.61)  (28 unrouted)
  Top 1.016: v113.03,67.31 R10.1 | 59.69,10.16 59.69,9.4 | 59.69,10.16 J2.1 | J4.1 59.69,10.16 | R3.1 111.42,63.16 v111.25,62.99 | v65.53,35.81 103.89,35.81 109.73,41.66 v109.73,74.42 | C1.2 v116.33,50.8 | J3.1 J5.1
  Top 1.27: v119.38,73.66 C11.2
  Bottom 1.016: v113.03,67.31 113.03,67.06 | v111.25,62.99 111.51,62.99 | J2.1 59.69,16.51 60.2,17.02 64.77,17.02 | 64.77,17.02 65.53,17.78 v65.53,35.81 | v109.73,74.42 110.74,74.42 | v116.33,50.8 116.08,50.8 | 64.77,17.02 J3.1
  Bottom 1.27: 119.13,73.66 v119.38,73.66 | 130.05,54.61 R7.2 | R5.2 125.73,53.85 126.49,54.61 130.05,54.61 | 130.05,54.61 X1.1 133.1,54.61 133.86,53.85 R6.2
I2C_SCL_(5V)  (3 unrouted)
  Top 0.254: IC5.42 75.07,61.1 76.96,62.99 76.96,75.69 76.45,76.2
I2C_SDA_(5V)  (3 unrouted)
L_BALL_IN_SENSOR  (via drill 0.61)  (1 unrouted)
  Top 0.406: R38.1 50.8,84.58 J7.3 | IC5.8 69.16,51.74 v68.83,52.07
  Bottom 0.406: 52.07,72.39 52.07,83.57 51.14,84.49 R38.1 50.8,84.58 J7.3 | v68.83,52.07 66.8,52.07 66.29,52.58 66.29,68.07
L_BALLS_LID_PWM_(5V)  (via drill 0.61)
  Top 0.406: R50.1 126.49,41.91 | IC5.27 85.64,52.54 86.87,51.31 86.87,42.67 87.63,41.91 v103.63,41.91
  Top 1.016: R50.1 130.72,41.82 J17.3
  Bottom 0.406: J17.3 128.27,41.91 127,40.64 109.98,40.64 108.71,41.91 v103.63,41.91
L_CORN_HOLD_PWM_(5V)  (via drill 0.61)
  Top 0.406: R52.1 117.6,41.91 | v102.62,42.93 97.54,42.93 96.27,44.2 96.27,62.99 95,64.26 87.63,64.26 86.36,62.99 86.36,58.17 85.53,57.34 IC5.33
  Top 1.016: J19.3 121.83,41.82
  Top 1.27: J19.3 R52.1
  Bottom 0.406: v102.62,42.93 109.22,42.93 110.24,41.91 J19.3
L_CORN_MOT_INA_(5V)  (via drill 0.61)
  Top 0.254: IC5.10 70.71,50.14 70.36,49.78 70.36,43.43 71.12,42.67 v71.12,39.62
  Top 0.406: IC11.2 81.92,28.57 81.28,29.21 81.28,31.75 | 82.55,31.75 R63.1 81.28,31.75 | v78.49,33.02 80.77,33.02 81.28,32.51 81.28,31.75 | v71.12,39.62 71.12,39.88
  Bottom 0.406: v78.49,33.02 73.66,33.02 71.12,35.56 v71.12,39.62
L_CORN_MOT_INB_(5V)  (via drill 0.61)
  Top 0.254: IC5.11 71.18,49.34 71.12,49.28 71.12,43.94 72.39,42.67 v72.39,39.62
  Top 0.406: R64.1 81.28,24.13 80.52,24.89 80.52,26.16 | IC11.4 80.64,26.04 80.52,26.16 | 80.52,26.16 80.52,31.24 v79.76,32 | v72.39,39.62 72.39,39.88
  Bottom 0.406: v79.76,32 79.76,33.53 79.25,34.04 74.17,34.04 72.39,35.81 v72.39,39.62
L_ENC_CHA  (1 unrouted)
  Bottom 0.406: 76.2,81.28 J13.3
L_ENC_CHB  (1 unrouted)
  Bottom 0.406: 78.74,81.28 J13.4
L_MOT_BREAK  (via drill 0.61)  (1 unrouted)
  Top 0.254: J22.1 24.13,23.62 23.11,24.64 16.26,24.64 13.72,27.18 13.72,40.89
  Top 0.406: IC4.13 44.25,43.89 v44.7,43.43
L_MOT_CURRENT  (via drill 0.61)
  Top 0.406: v22.35,14.99 22.35,16.26 22.86,16.76 46.48,16.76 47.24,17.53 47.24,31.5 v49.53,33.78 | v54.86,43.18 54.86,56.64 54.43,57.08 IC4.24
  Bottom 0.406: IC15.7 22.23,16.13 22.35,16 v22.35,14.99 | v49.53,33.78 49.53,37.85 50.29,38.61 52.83,38.61 54.1,39.88 54.1,42.42 v54.86,43.18
L_MOT_REV  (via drill 0.61)  (1 unrouted)
  Top 0.254: J22.2 21.59,23.37 20.83,24.13 16,24.13 13.21,26.92 13.21,40.89
  Top 0.406: IC4.12 43.45,42.91 v43.94,42.42
L_MOT_VREF  (via drill 0.61)
  Top 0.406: R70.2 21.84,36.83 22.1,36.58 22.1,35.05 | IC14.1 21.97,34.92 22.1,35.05 | v22.1,28.96 22.1,35.05
  Bottom 0.406: v22.1,28.96 22.1,25.91 21.34,25.15 19.81,25.15 19.05,24.38 J22.3
L_MOT_VREF_N  (via drill 0.61)  (1 unrouted)
  Top 0.305: R72.1 21.68,39.2 21.59,39.37
  Top 0.406: IC4.15 45.85,45.85 v46.23,45.47 | 21.59,39.37 v21.59,41.91
L_MOT_VREF_P  (via drill 0.61)  (1 unrouted)
  Top 0.305: R74.1 17.11,36.66 17.53,37.08
  Top 0.406: 17.53,37.08 17.53,38.61 18.54,39.62 v18.54,41.91 | IC4.14 45.05,44.8 v45.47,44.45
L_WALL_SENSOR  (1 unrouted)
  Top 0.406: 50.8,69.85 50.8,75.69 | 50.8,75.69 R46.1 | 50.8,75.69 J11.3
  Bottom 0.406: 51.05,75.69 R46.1 50.89,76.03 50.8,75.95 J11.3
LASER_BALL_SCAN  (via drill 0.61)
  Top 0.254: 53.51,27.27 53.76,27.27 53.85,27.18 53.85,26.92 55.88,26.92
  Top 0.406: 53.85,26.92 53.51,27.27 R25.2 53.34,27.18 53.72,26.8 IC6.1 | 56.64,26.92 55.88,26.92 56.9,26.92 57.66,27.69 57.66,30.73 v58.93,32 | IC4.26 55.37,58.68 56.39,57.66 56.39,45.72 v59.94,42.16
  Bottom 0.406: v58.93,32 59.69,32.77 59.69,41.91 v59.94,42.16
LASER_CORN_SCAN  (via drill 0.61)
  Top 0.406: 63.5,25.53 IC6.7 59.56,25.53 58.93,26.16 v58.93,30.48 | IC4.25 54.9,57.88 55.63,57.15 55.63,44.96 v58.42,42.16
  Top 0.61: 63.5,25.53 R30.2
  Bottom 0.406: v58.93,30.48 58.17,30.48 57.66,30.99 57.66,32.77 58.93,34.04 58.93,41.66 v58.42,42.16
MAIN_LED1  (1 unrouted)
  Bottom 0.254: R18.1 3.64,13.8 5.33,15.49 5.33,20.83 2.29,23.88 2.29,29.46 3.05,30.23 8.89,30.23 10.16,31.5 10.16,42.42 14.73,46.99 14.73,52.58 17.02,54.86 28.7,54.86 30.23,56.39 30.23,61.21
MAIN_LED2  (1 unrouted)
  Bottom 0.254: R19.1 3.64,16.85 4.83,18.03 4.83,20.57 1.78,23.62 1.78,29.97 2.54,30.73 8.64,30.73 9.65,31.75 9.65,42.67 14.22,47.24 14.22,52.83 16.76,55.37 28.45,55.37 29.72,56.64 29.72,60.45
MAIN_LED3  (1 unrouted)
  Top 0.406: IC4.2 39.35,63.48 37.85,61.98 37.85,53.34
  Bottom 0.254: R15.1 3.81,10.67 4.83,11.68 4.83,14.22 5.84,15.24 5.84,21.08 2.79,24.13 2.79,28.96 3.56,29.72 9.14,29.72 10.67,31.24 10.67,42.16 15.24,46.74 15.24,52.32 17.27,54.36 28.96,54.36 30.73,56.13 30.73,59.18
MAIN_LED4  (1 unrouted)
  Bottom 0.254: R14.1 3.81,7.62 5.33,9.14 5.33,13.97 6.35,14.99 6.35,21.34 3.3,24.38 3.3,28.7 3.81,29.21 9.4,29.21 11.18,30.99 11.18,41.91 15.75,46.48 15.75,52.07 17.53,53.85 29.21,53.85 31.24,55.88 31.24,60.96
MAIN_PGED  (via drill 0.61)  (1 unrouted)
  Top 0.254: JP1.1 12.7,21.08 11.68,22.1 11.68,44.7 | IC4.21 50.65,53.49 v51.56,52.58
  Bottom 0.254: v51.56,52.58 51.56,51.82 51.05,51.31 19.81,51.31
MAIN_UART_RX  (1 unrouted)
  Top 0.406: JP3.2 JP2.1 JP3.2
  Bottom 0.406: JP3.2 2.54,60.96 3.3,61.72 26.67,61.72
MAIN_UART_TX  (1 unrouted)
  Top 0.406: JP2.2 1.27,66.04 1.27,57.66 1.78,57.15 JP3.1
  Bottom 0.406: 26.67,60.96 4.57,60.96 3.81,60.2 3.81,58.42 JP3.1
N$1  (via drill 0.61)
  Top 0.406: LED10.C 1.74,18.25 v1.78,18.29
  Bottom 0.406: R23.2 1.78,19.81 v1.78,18.29
N$2
  Bottom 0.61: 77.22,12.19 77.19,12.17 IC8.8 | 77.98,12.19 77.72,12.19 | 80.64,12.06 IC8.5 80.29,12.17 80.26,12.19 80.24,12.17 | IC8.6 79.27,12.17 79.25,12.19 79.22,12.17 78.72,12.17
  Bottom 1.27: 78.72,12.17 78.51,12.17 | 78.51,12.17 IC8.7 | 78.51,12.17 77.98,12.19 | 78.72,12.17 78.74,11.94 X4.2 | 77.72,12.19 77.22,12.19 | 78.72,12.17 IC8.6 80.24,12.17
N$3
  Top 1.27: R8.1 128.27,87.63 | IC3.1 133.35,85.09 133.35,86.36 132.08,87.63 128.27,87.63 | 128.27,87.63 R12.2
N$4
  Top 0.61: IC9.8 75.46,12.17 75.44,12.19 75.16,12.17 | IC9.6 73.13,12.17 73.15,12.19 73.18,12.17 73.64,12.17 73.66,11.94 | IC9.5 71.86,12.17 71.88,12.19 72.16,12.17 | X4.1 73.66,5.59
  Top 1.27: 75.16,12.17 IC9.7 73.18,12.17 72.16,12.17 | X4.1 73.66,11.94
N$5
  Top 0.406: R27.1 51.47,17.36 52.07,16.76 53.85,16.76 54.61,16 J2.3
N$6
  Bottom 0.61: 80.77,21.59 R58.2 78.23,21.59 78.11,21.46 IC8.2 | R60.2 82.55,21.59 80.77,21.59 | IC8.4 80.64,21.46 80.77,21.59
N$7
  Top 0.61: IC9.2 74.3,21.46 74.17,21.59 | 74.17,21.59 R57.2 | R59.2 70.1,21.59 71.88,21.59 | 71.88,21.59 74.17,21.59 | IC9.4 71.75,21.46 71.88,21.59
N$8  (via drill 0.61)
  Top 0.406: LED8.C 1.74,12.16 v1.78,12.19
  Bottom 0.406: R18.2 1.78,13.72 v1.78,12.19
N$10  (via drill 0.61)
  Top 0.406: LED9.C 1.74,15.21 v1.78,15.24
  Bottom 0.406: R19.2 1.78,16.76 v1.78,15.24
N$11  (via drill 0.61)
  Top 0.406: LED7.C 1.74,9.11 v1.78,9.14
  Bottom 0.406: R15.2 1.78,10.67 v1.78,9.14
N$12
  Top 1.016: LED5.C R11.2
N$13  (via drill 0.61)
  Top 0.406: LED6.C 1.74,6.06 v1.78,6.1
  Bottom 0.406: R14.2 1.78,7.62 v1.78,6.1
N$14
  Top 0.61: IC7.7 75.06,28.57 74.42,27.94 74.42,24.13 75.69,22.86 75.69,21.84 75.78,21.76 R57.1
N$15  (via drill 0.61)
  Top 0.61: IC7.5 76.73,23.65 v76.71,23.62
  Bottom 0.61: 76.71,21.59 R58.1 76.62,21.76 76.71,21.84 v76.71,23.62
N$16
  Bottom 0.61: IC20.5 14.17,83.88 14.73,83.31 21.08,83.31 21.67,83.9 IC20.10
N$17
  Bottom 0.61: IC12.6 89.64,12.17 89.66,12.19 89.69,12.17 | IC12.7 88.16,12.17 88.14,12.19 | 87.38,12.19 87.1,12.17 IC12.8 | IC12.5 90.45,12.17 90.42,12.19 90.4,12.17
  Bottom 1.27: 88.9,12.17 88.16,12.17 | 88.9,12.17 IC12.6 | 88.14,12.19 87.38,12.19 | 89.69,12.17 90.4,12.17 | X8.2 88.9,12.17
N$18
  Top 0.61: IC13.7 84.35,12.17 84.33,12.19 | IC13.6 83.08,12.17 83.06,12.19 | IC13.5 82.02,12.17 82.04,12.19 82.32,12.17 | IC13.8 85.57,12.17 85.34,12.19 85.11,12.17 | 83.82,12.17 83.82,12.19
  Top 1.27: 83.82,12.17 IC13.6 82.32,12.17 | 83.82,12.17 IC13.7 85.11,12.17 | X8.1 83.82,12.17
N$19
  Bottom 0.61: IC12.4 90.81,21.46 90.68,21.59 90.17,21.59 | 90.17,21.59 R66.2 88.39,21.59 88.27,21.46 IC12.2 | R69.2 92.71,21.59 90.17,21.59
N$20
  Top 0.61: IC13.2 84.45,21.46 84.33,21.59 | IC13.4 81.92,21.46 82.04,21.59 | 84.33,21.59 R65.2 | 82.04,21.59 84.33,21.59 | R68.2 80.18,21.68 80.26,21.59 82.04,21.59
N$21
  Top 0.61: IC11.7 87.76,28.57 87.12,27.94 87.12,24.13 86.11,23.11 86.11,21.84 85.94,21.68 R65.1
N$22  (via drill 0.61)
  Top 0.61: IC11.5 89.43,23.65 v89.15,23.37
  Bottom 0.61: v89.15,23.37 87.38,23.37 86.87,22.86 86.87,21.59 R66.1
N$23
  Top 0.61: IC10.7 111.12,28.57 113.03,26.67 113.03,22.86 114.3,21.59 120.4,21.59 121.41,22.61 121.41,25.15 K1.2
  Bottom 1.27: D1.A 120.65,21.59 121.67,22.61 121.67,24.89 121.41,25.15 K1.2
N$24
  Top 1.27: K1.O 121.67,13.21 122.94,14.48 | 122.94,14.48 121.67,14.48 | 122.94,14.48 X6.1 132.59,14.48 133.35,15.24 133.35,23.62 132.33,24.64 X5.1 130.05,24.64
N$25
  Bottom 0.61: 62.23,9.14 50.04,9.14 49.53,8.64 J4.5 | 62.23,9.14 R34.1 | 62.23,9.14 J5.2
N$26
  Top 1.27: K1.P 115.57,28.19 117.09,29.72 X5.2
N$27
  Top 0.406: C43.2 21.84,51.05 21.72,51.18 IC21.1
N$28
  Bottom 0.61: 62.23,11.18 50.29,11.18 49.53,11.94 J2.5 | 62.23,11.18 R29.1 | 62.23,11.18 J3.2
N$30
  Top 0.406: IC21.3 20.19,53.72 20.32,53.59 21.59,53.59 21.84,53.34 C43.1
N$31
  Top 0.406: C46.2 21.84,54.86 21.72,54.99 IC21.4
N$32
  Top 0.406: C46.1 21.84,56.39 21.72,56.26 IC21.5
N$33
  Top 0.61: C44.1 17.36,51.9 17.91,52.45 IC21.2
N$34
  Top 0.406: C47.2 21.84,57.66 21.72,57.53 IC21.6
N$35
  Top 1.27: X6.2 111.51,19.56 109.73,17.78 109.73,13.21 K1.S 109.47,12.95
N$36
  Top 0.406: IC6.2 53.72,25.53 53.43,25.57 R25.1 51.4,25.57 51.31,25.65 | 51.31,25.65 51.05,25.91 | R26.2 51.31,25.65
N$38
  Top 0.61: 130.3,4.32 X7.1 125.98,4.32 122.17,8.13 107.95,8.13 105.92,10.16 105.92,20.57 102.13,24.36 IC10.5
  Bottom 1.27: D2.A 125.64,4.66 125.98,4.32 X7.1
N$40
  Top 0.406: R28.2 53.59,23.37 53.59,23.88 | R28.2 53.17,23.46 53.98,24.26 IC6.3 | R28.2 53.17,21.25 53.34,21.08 C26.1 53.17,18.71 | R27.2 53.17,18.71 | 53.17,18.71 53.34,18.54
N$43
  Top 1.27: IC3.3 133.35,80.01 133.35,70.87 132.33,69.85 130.3,69.85 | C10.+ 122.68,69.85 | 122.68,69.85 X2.2 130.3,69.85 | F2.1 129.54,76.2 130.3,75.44 130.3,69.85 | C11.1 122.77,69.94 122.68,69.85
N$47
  Top 0.406: IC4.31 58.62,62.68 59.44,63.5 Q1.2 59.6,66.89 C18.1
N$48
  Top 0.406: IC4.30 58.77,61.88 59.44,61.21 59.44,57.66 | 59.44,57.66 Q1.1 | C17.1 59.52,57.57 59.44,57.66
N$49  (via drill 0.61)
  Top 0.406: IC4.7 43.46,59.48 v43.66,59.28
  Bottom 0.406: 41.88,58.27 C15.+ 42.9,59.28 v43.66,59.28
N$50
  Top 0.406: IC5.31 89.27,55.74 89.92,56.39 Q2.2 90,60.29
  Top 1.016: 90,60.29 C24.1
N$51
  Top 0.406: IC5.30 89.33,54.94 89.92,54.36 Q2.1 90,50.46
  Top 1.016: 90,50.46 C23.1
N$52  (via drill 0.61)
  Top 0.406: IC5.7 73.7,52.54 v73.91,52.32
  Bottom 0.406: C21.+ 71.88,51.82 72.14,51.82 72.64,52.32 v73.91,52.32
N$61
  Top 0.406: IC14.2 18.92,33.66 18.54,34.04 18.54,36.32 19.05,36.83 R70.1 20.07,36.83 19.98,36.92 R72.2
N$64
  Top 1.016: 113.03,63.25 112.94,63.33 | LED1.C 113.03,63.25 | R3.2 113.12,63.33 113.03,63.25
N$65
  Top 1.016: R4.2 106.68,47.24 LED2.C
N$66
  Top 1.016: LED4.C 113.54,73.66 113.03,73.15 R10.2
N$67
  Top 1.016: R9.2 LED3.C
N$70
  Top 0.406: IC14.3 17.14,32.38 17.02,32.51 R76.2 R74.2 17.02,35.05
N$71
  Top 0.406: IC14.6 29.59,32.38 30.23,33.02 30.23,34.54 R71.1 30.31,36.66 30.48,36.83 R73.2
N$72
  Bottom 0.406: 23.6,10.9 IC15.1 | 22.86,10.9 IC15.2 | 22.86,10.9 23.6,10.9 | 23.6,10.9 23.62,10.92 | 22.86,10.16 22.86,10.9
  Bottom 1.27: X9.1 22.86,10.16
N$73
  Bottom 0.406: IC15.6 20.95,18.41 20.57,18.8 18.03,18.8 17.78,18.54 C36.2
N$74
  Top 0.406: 28.96,30.99 28.7,30.99 29.12,31.15 | 28.96,30.99 R75.2 | 27.18,31.11 IC14.5 | 27.18,31.11 28.83,31.11 28.96,30.99 | R77.2 27.18,29.21 27.18,31.11
N$75
  Top 0.406: IC17.6 44.07,32.38 44.45,32 R85.2 R81.1 44.45,34.54
N$76
  Bottom 0.406: IC16.1 33.55,10.9 33.53,10.92 33.5,10.9 | 33.5,10.9 IC16.2 | 33.5,10.9 33.05,10.9 33.02,10.92 33.02,10.16
  Bottom 1.27: X10.1 33.02,10.16
N$77
  Bottom 0.406: IC16.6 31.11,18.41 30.73,18.8 28.45,18.8 27.94,18.29 C38.2
N$78
  Bottom 0.406: IC18.1 43.71,10.9 43.69,10.92 43.66,10.9 | 43.66,10.9 IC18.2 | 43.66,10.9 43.2,10.9 43.18,10.92 43.18,10.16
  Bottom 1.27: 43.18,6.86 X11.1 43.18,10.16
N$79
  Bottom 0.406: C42.2 38.1,18.29 38.61,18.8 40.89,18.8 41.27,18.41 IC18.6
N$83
  Top 0.406: IC17.2 34.92,33.66 34.54,34.04 34.54,36.32 35.05,36.83 35.81,36.83 | 36.07,36.83 R80.1 35.81,36.83 | R82.2 35.98,37 35.81,36.83
N$84
  Top 0.406: R84.2 33.02,32.77 33.4,32.38 IC17.3 | R84.2 33.02,32.51 | R84.2 R83.2
N$93
  Top 0.61: IC19.10 12.62,72.31 13.21,72.9 13.21,79.25 12.64,79.81 IC19.5
N$94
  Top 0.406: IC6.6 63.5,24.26 R30.1 R31.2
N$95
  Top 0.406: 60.96,21.08 C29.1 | 60.96,21.08 R33.2 58.42,21.08 58.42,18.8 R32.2 | IC6.5 60.96,22.99 60.96,21.08
N$96
  Top 0.406: J4.3 54.61,8.89 55.88,10.16 55.88,17.78 56.9,18.8 R32.1
N$112  (1 unrouted)
  Top 1.27: F1.1 X1.2 | R1.2 133.86,57.91 132.08,59.69 130.81,59.69
PGEC  (via drill 0.61)  (1 unrouted)
  Top 0.254: CN1.5 9.91,8.89 11.43,7.37 14.48,7.37 15.49,8.38 15.49,19.81 12.7,22.61 12.7,44.7 | IC5.22 81.47,46.04 v81.79,45.72
  Top 0.305: IC4.22 52.2,54.48 52.83,53.85 v52.83,47.24 52.72,47.35
  Bottom 0.254: v81.79,45.72 81.79,44.2 80.77,43.18 70.87,43.18 69.09,44.96 61.72,44.96 58.93,47.75 54.36,47.75 53.85,47.24 v52.83,47.24 49.78,47.24 49.28,46.74
PGED
  Top 0.61: CN1.4 JP1.2
R_BALL_IN_SENSOR  (via drill 0.61)  (2 unrouted)
  Top 0.406: R36.1 43.18,84.58 J6.3 | IC5.9 68.19,50.94 v68.07,51.05
  Bottom 0.406: v68.07,51.05 66.29,51.05 65.53,51.82 65.53,68.07
R_BALLS_LID_PWM_(5V)  (via drill 0.61)
  Top 0.254: J16.3 126.49,34.29
  Top 0.406: 126.49,34.29 R49.1 | IC5.24 84.23,50.14 84.58,49.78 84.58,40.89 86.61,38.86 v102.62,38.86
  Top 1.016: R49.1 130.72,34.2 J16.3
  Bottom 0.406: J16.3 128.27,34.29 126.24,32.26 109.98,32.26 107.95,34.29 107.95,38.1 107.19,38.86 v102.62,38.86
R_CORN_HOLD_PWM_(5V)  (via drill 0.61)
  Top 0.406: R51.1 117.6,34.29 | v103.63,39.88 87.12,39.88 85.34,41.66 85.34,50.29 84.7,50.94 IC5.25
  Top 1.016: R51.1 121.83,34.2 J18.3
  Bottom 0.406: J18.3 119.38,34.29 118.11,33.02 110.49,33.02 108.71,34.8 108.71,38.86 107.7,39.88 v103.63,39.88
R_CORN_MOT_INA_(5V)  (via drill 0.61)
  Top 0.254: v68.58,39.62 68.58,41.15 66.55,43.18 66.55,55.88 67.21,56.54 IC5.2
  Top 0.61: IC7.2 68.96,28.57 v68.83,28.7 68.83,30.73 69.76,31.66 R55.1
  Bottom 0.406: v68.83,28.7 68.58,28.96 v68.58,39.62
R_CORN_MOT_INB_(5V)  (via drill 0.61)
  Top 0.254: IC5.3 67.42,55.74 67.06,55.37 67.06,43.94 69.85,41.15 v69.85,39.62
  Top 0.61: v68.83,25.91 68.96,26.04 IC7.4 70.23,26.04 70.1,25.91 70.1,24.38 69.85,24.13 R56.1
  Bottom 0.406: v68.83,25.91 69.34,25.91 69.85,26.42 v69.85,39.62
R_ENC_CHA  (1 unrouted)
  Bottom 0.406: 86.36,81.28 J12.3
R_ENC_CHB  (1 unrouted)
  Bottom 0.406: 88.9,81.28 J12.4
R_MOT_BREAK  (via drill 0.61)  (1 unrouted)
  Top 0.254: J23.1 34.29,23.88 33.02,25.15 24.13,25.15 23.62,25.65 16.76,25.65 14.73,27.69 14.73,40.89
  Top 0.406: IC4.9 40.1,57.88 39.37,57.15 39.37,42.93 v39.62,42.67
R_MOT_CURRENT  (via drill 0.61)
  Top 0.406: v32.51,14.99 33.53,16 46.74,16 48.01,17.27 48.01,30.48 v48.51,30.99 | v53.34,43.18 53.34,43.94 54.1,44.7 54.1,55.88 53.7,56.28 IC4.23
  Bottom 0.406: IC16.7 32.38,16.38 32.51,16.26 v32.51,14.99 | v48.51,30.99 48.51,37.85 50.04,39.37 52.32,39.37 53.34,40.39 v53.34,43.18
R_MOT_REV  (via drill 0.61)  (1 unrouted)
  Top 0.254: J23.2 31.75,23.88 30.99,24.64 23.88,24.64 23.37,25.15 16.51,25.15 14.22,27.43 14.22,40.89
  Top 0.406: IC4.8 39.63,58.68 38.61,57.66 v38.61,41.91
R_MOT_VREF  (via drill 0.61)
  Top 0.406: R71.2 28.7,34.54 27.81,33.66 | 27.81,33.66 IC14.7 | 27.81,33.66 23.75,33.66 23.37,33.27 v23.37,29.72
  Bottom 0.406: J23.3 29.21,24.38 28.45,25.15 24.13,25.15 23.37,25.91 v23.37,29.72
R_MOT_VREF_N  (via drill 0.61)  (1 unrouted)
  Top 0.406: R73.1 28.61,37 28.96,37.34 v28.96,41.91 | 41.65,46.23 41.65,45.98 41.66,45.97 | 41.65,46.23 IC4.11 | v41.66,44.96 41.65,46.23
R_MOT_VREF_P  (via drill 0.61)  (1 unrouted)
  Top 0.406: v31.5,41.91 31.5,32.26 30.73,31.5 R75.1 | IC4.10 40.57,57.08 40.13,56.64 40.13,43.94 v40.64,43.43
R_WALL_SENSOR  (via drill 0.61)  (1 unrouted)
  Top 0.254: IC4.27 52.11,59.48 51.31,58.67
  Top 0.406: 58.42,72.39 58.42,75.69 | 58.42,75.69 R48.1 | 58.42,75.69 J15.3 | IC4.27 54.65,59.48 v55.12,59.94
  Bottom 0.406: 58.67,75.69 R48.1 58.51,76.03 58.42,75.69 J15.3 | v55.12,59.94 55.12,72.14
RX_MAX232
  Top 0.406: JP3.4 3.81,58.42 3.81,56.13 4.83,55.12 9.65,55.12 10.79,56.26 IC21.12
RX_WT11
  Top 0.406: 5.59,69.09 5.08,68.58 JP2.4
  Top 0.61: IC19.6 8.97,78.31 7.87,77.22 7.87,71.37 5.59,69.09
SERVOS_UART_(5V)  (via drill 0.61)  (2 unrouted)
  Top 0.254: IC5.1 71.67,64.81 v72.39,65.53 | v80.01,65.53 80.01,67.82 78.49,69.34 78.49,76.71 78.99,77.22
  Bottom 0.254: v72.39,65.53 v80.01,65.53
  Bottom 0.61: 110.49,80.01 J21.3
SLAVE_LED1  (via drill 0.61)  (1 unrouted)
  Top 0.406: IC5.5 69.13,54.14 v68.07,53.09
  Bottom 0.254: R23.1 3.64,20.99 1.27,23.37 1.27,30.23 2.29,31.24 8.38,31.24 9.14,32 9.14,42.93 13.72,47.5 13.72,53.09 16.51,55.88 28.19,55.88 29.21,56.9 29.21,59.69
  Bottom 0.406: v68.07,53.09 67.56,53.09 67.06,53.59 67.06,68.07
SLAVE_PGED  (via drill 0.61)  (1 unrouted)
  Top 0.254: JP1.3 14.48,8.89 14.99,9.4 14.99,19.56 12.19,22.35 12.19,44.7 | IC5.21 80.67,46.08 v80.26,45.72
  Bottom 0.254: v80.26,45.72 80.26,44.2 79.76,43.69 71.12,43.69 69.34,45.47 61.98,45.47 59.18,48.26 49.78,48.26 48.77,47.24
SLAVE_UART_RX  (1 unrouted)
  Top 0.254: IC5.44 73.47,70.55 72.14,71.88 69.85,71.88
  Top 0.406: JP3.6 JP2.5 JP3.6
  Bottom 0.406: JP2.5 8.64,63.75 26.42,63.75
SLAVE_UART_TX  (1 unrouted)
  Top 0.254: IC5.43 74.27,70.51 72.39,72.39 69.85,72.39
  Top 0.406: JP3.5 6.35,58.42 6.35,66.04 JP2.6
  Bottom 0.406: 26.42,62.99 7.37,62.99 6.35,64.01 6.35,66.04 JP2.6
START  (1 unrouted)
  Top 0.813: R22.1 65.87,75.78 66.04,75.95 J1.3
SUCKER_OBJ_SENSOR  (1 unrouted)
  Top 0.406: R44.1 43.27,76.03 43.18,75.95 J10.3
  Bottom 0.406: R44.1 43.18,75.69 J10.3
TO_RX_RS232_M  (via drill 0.61)
  Top 0.406: IC21.14 12.83,53.72 12.7,53.59 3.56,53.59 v1.78,51.82
  Bottom 0.406: v1.78,51.82 1.78,36.32 2.79,35.31 CON1.2
TX_MAX232
  Top 0.406: IC21.11 10.79,57.53 9.14,55.88 6.35,55.88 JP3.3
TX_WT11
  Top 0.406: JP2.3 3.81,66.04 3.81,68.33
  Top 0.61: 3.81,68.33 3.81,69.09 6.86,72.14 6.86,77.72 9.4,80.26 9.4,87.12 10.41,88.14 26.67,88.14 27.94,86.87 27.94,83.82 26.93,82.81 IC19.26
VACUUM_REV  (via drill 0.61)
  Top 0.406: R62.1 93.73,24.13 93.22,24.64 93.22,26.16 | 93.22,26.16 93.22,31.24 v92.46,32 | IC10.4 93.34,26.04 93.22,26.16 | IC5.34 85.05,59.14 85.6,59.69 85.6,63.5 87.12,65.02 95.5,65.02 97.03,63.5 97.03,45.21 98.04,44.2 v98.55,44.2
  Bottom 0.406: v98.55,44.2 98.55,34.8 97.79,34.04 93.22,34.04 92.46,33.27 v92.46,32
VACUUM_SENSOR  (1 unrouted)
  Top 0.254: IC5.32 81.13,56.54 81.03,56.64
  Top 0.406: R42.1 66.04,84.58 J9.3
  Bottom 0.406: 67.31,69.85 67.31,83.57 66.38,84.49 R42.1 66.04,84.58 J9.3
VCC_SERVO_5V
  Top 1.27: 133.86,44.45 133.86,38.1 132.59,36.83 J16.2 | 133.86,44.45 R1.1 | 133.86,44.45 J17.2
  Bottom 1.27: J17.2 J19.2 | J16.2 J18.2 J20.2
VCC_SERVO_9.6V  (1 unrouted)
  Top 1.016: LED5.A 114.52,82.52 114.55,82.55
  Top 1.27: 120.65,82.55 124.21,82.55 | 124.21,82.55 128.27,82.55 | 128.27,82.55 IC3.2 | 124.21,82.55 124.24,82.52 | 128.27,82.55 R8.2 | 120.65,82.55 C13.1 | 120.65,82.55 114.55,82.55 110.49,82.55 107.95,85.09 J21.2
VOFF_2V
  Top 0.406: 39.75,33.66 IC17.7 | IC17.5 39.75,31.11 39.37,31.24
  Top 0.61: R84.1 33.11,30.9 33.27,30.73
  Top 0.813: 39.75,33.66 39.37,33.27 39.37,31.24 39.37,28.45 38.61,27.69 33.02,27.69 | R76.1 17.02,28.45 17.78,27.69 24.89,27.69 | 24.89,27.69 33.02,27.69 | 33.27,30.73 33.02,30.73 33.02,27.69 | R77.1 24.89,29.21 24.89,27.69